# EAGLE design v1 (EAGLE 9.5.2)
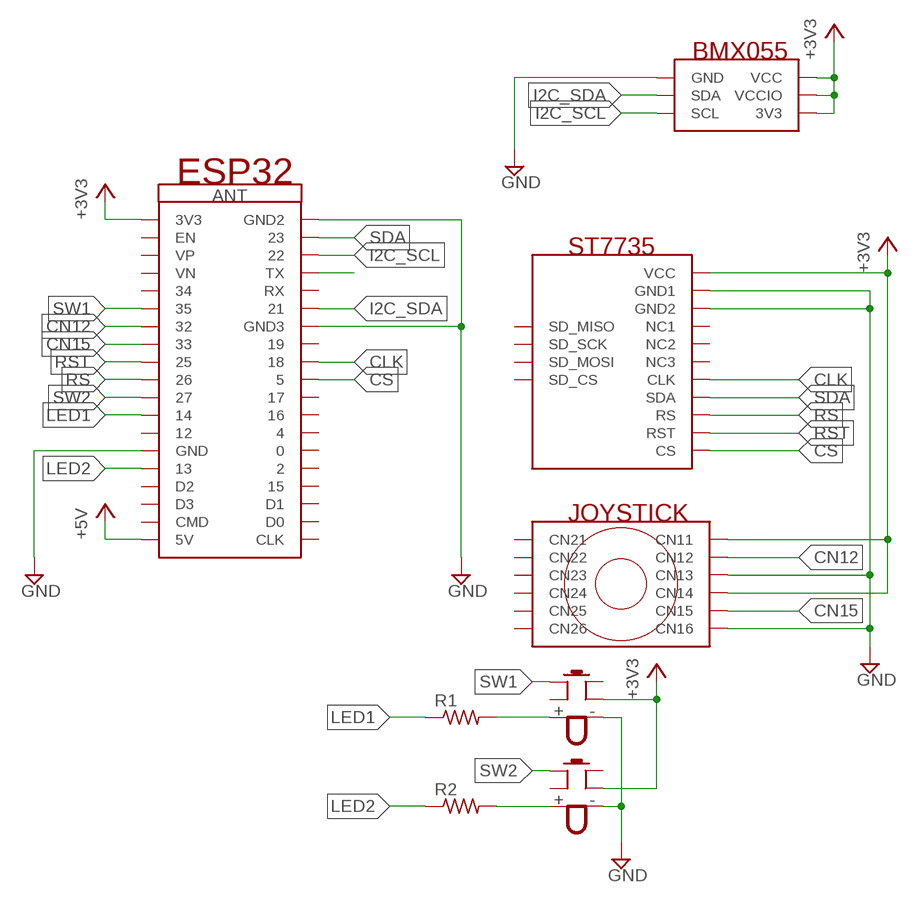
[diagram p0: schematic, sheet 1]

## Parts
R1  R-US_0309/12  [0309/12]
R2  R-US_0309/12  [0309/12]
U$1  ST7735  [ST7735]
U$2  JOYSTICK  [JOYSTICK]
U$3  ESP32  [ESP32]
U$4  PUSH_SW_LED  [PUSH_SW_LED]
U$5  PUSH_SW_LED  [PUSH_SW_LED]
U$6  BMX055  [BMX055]

## Nets
+3V3: U$1.VCC U$2.CN11 U$2.CN14 U$3.3V3 U$4.P$6(P4) U$5.P$6(P4) U$6.3V3 U$6.VCC U$6.VCCIO
+5V: U$3.5V
CLK: U$1.CLK U$3.18
CN12: U$2.CN12 U$3.32
CN15: U$2.CN15 U$3.33
CS: U$1.CS U$3.5
GND: U$1.GND1 U$1.GND2 U$2.CN13 U$2.CN16 U$3.GND U$3.GND2 U$3.GND3 U$4.P$4(PO) U$5.P$4(PO) U$6.GND
I2C_SCL: U$3.22 U$6.SCL
I2C_SDA: U$3.21 U$6.SDA
LED1: R1.1 U$3.14
LED2: R2.1 U$3.13
N$1: U$3.TX
N$3: R1.2 U$4.P$3(PI)
N$4: R2.2 U$5.P$3(PI)
RS: U$1.RS U$3.26
RST: U$1.RST U$3.25
SDA: U$1.SDA U$3.23
SW1: U$3.35 U$4.P$1(P1)
SW2: U$3.27 U$5.P$1(P1)
Unconnected: U$1.NC1 U$1.NC2 U$1.NC3 U$1.SD_CS U$1.SD_MISO U$1.SD_MOSI U$1.SD_SCK U$2.CN21 U$2.CN22 U$2.CN23 U$2.CN24 U$2.CN25 U$2.CN26 U$3.0 U$3.2 U$3.4 U$3.12 U$3.15 U$3.16 U$3.17 U$3.19 U$3.34 U$3.CLK U$3.CMD U$3.D0 U$3.D1 U$3.D2 U$3.D3 U$3.EN U$3.RX U$3.VN U$3.VP U$4.P$2(P2) U$4.P$5(P3) U$5.P$2(P2) U$5.P$5(P3)

## Library data of the parts
R1 R2 = rcl:R-US_: RESISTOR, American symbol; SPICEPREFIX: R
U$1 = ILI9341:ST7735
U$2 = JOYSTICK:JOYSTICK
U$3 = ESP32:ESP32
U$4 U$5 = Switch:PUSH_SW_LED
U$6 = Sensor:BMX055

## Board
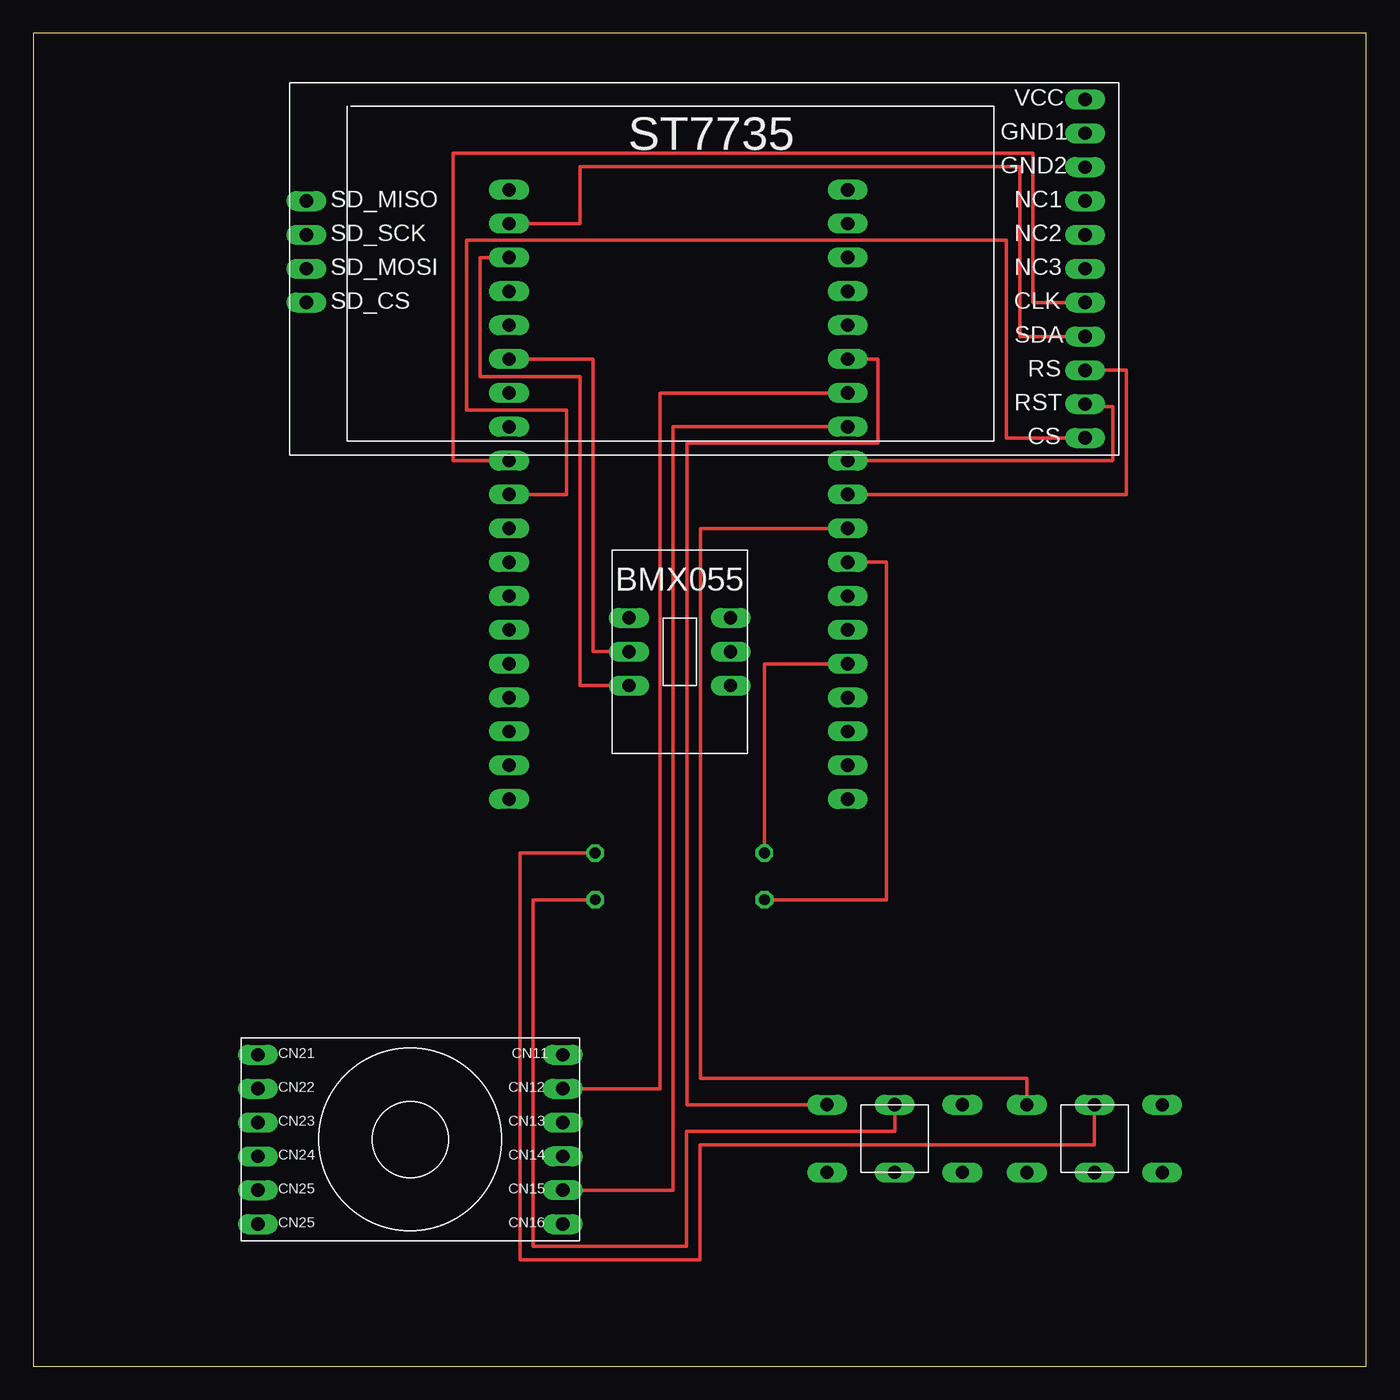
[diagram p1: board, top side]
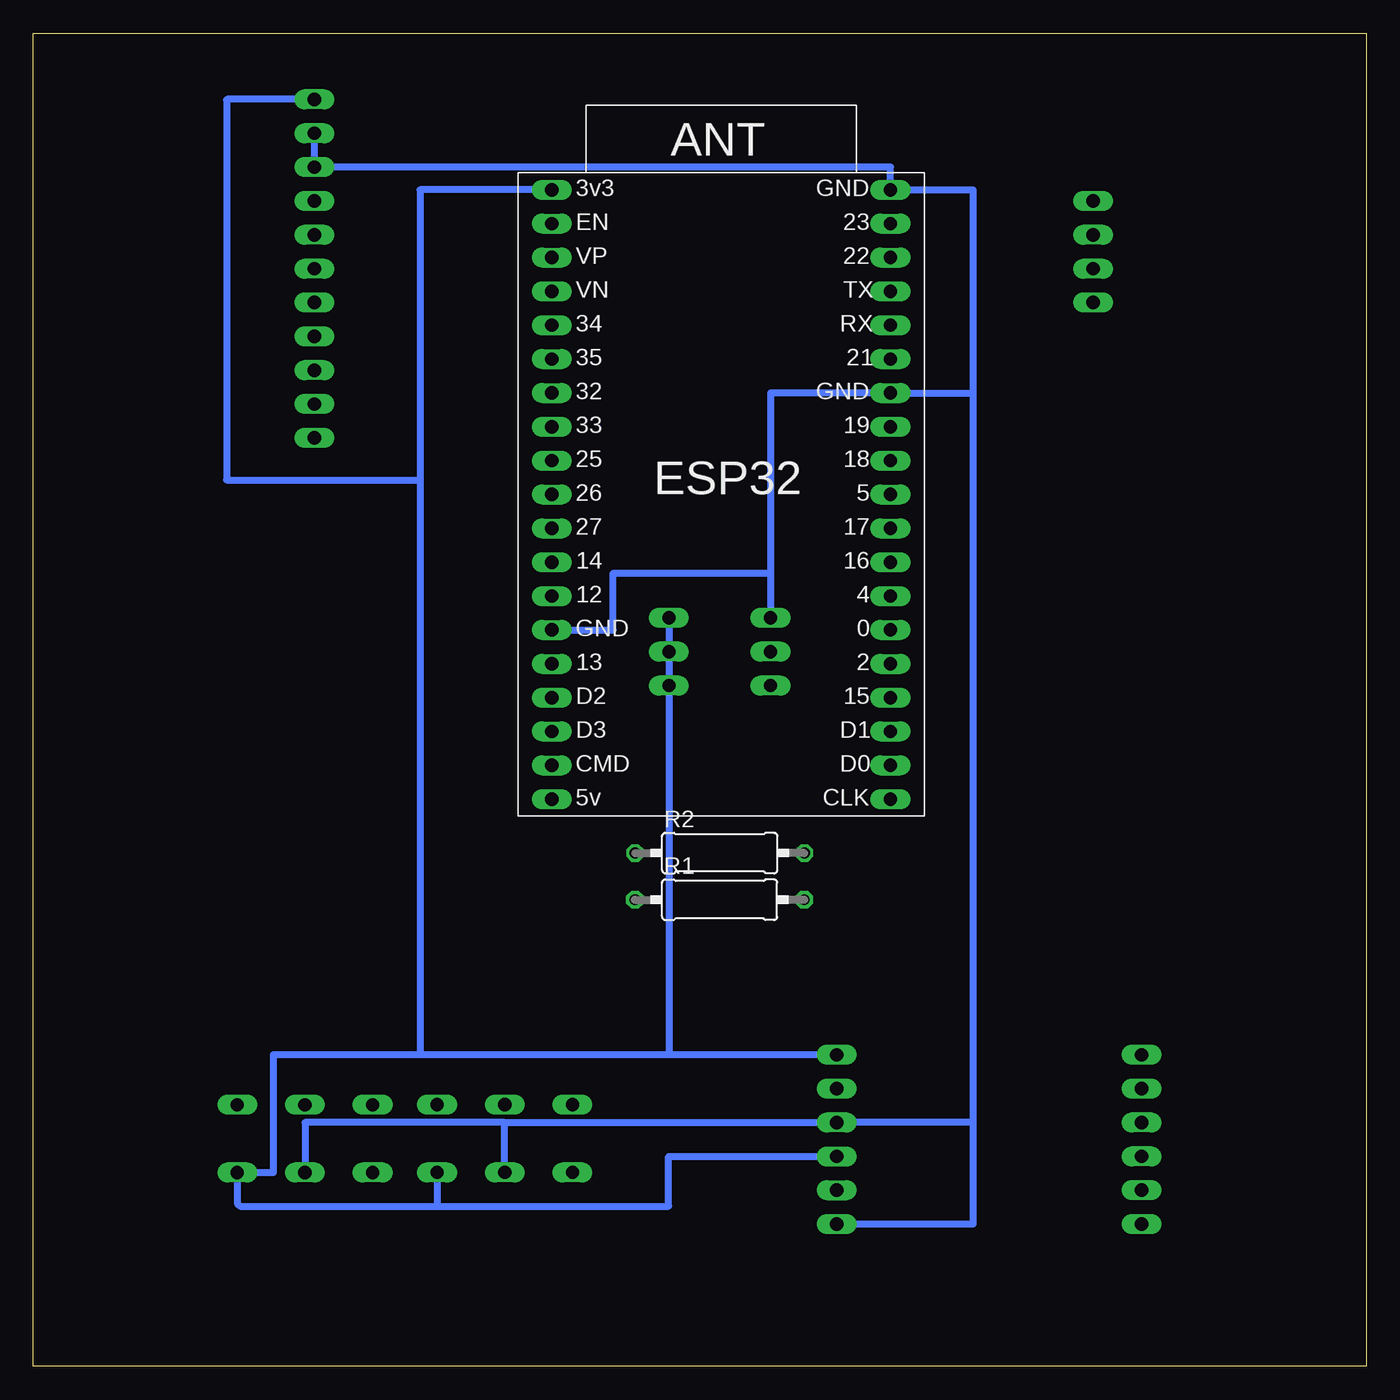
[diagram p2: board, bottom side, seen from below]

Size 100 x 100 mm. Coordinates in mm from the lower left corner, seen from the top.
Outline: 0,0 100,0 100,100 0,100 0,0
Copper layers (1*16): Top 0.035mm / dielectric 1.5mm / Bottom 0.035mm
Design rules "default": minimum track width 6mil, minimum drill 0.35mm, track to track 6mil, track to pad 6mil, pad to pad 6mil, via to via 6mil, smd to smd 6mil, copper to edge 40mil, drill to drill 6mil, minimum pad ring 10mil, minimum via ring 8mil, stop-mask expansion 4mil, vias tented up to drill 0mil, thermal gap 10mil

### Footprints (pad centres in the part's own frame; a part is rotated, then mirrored left to right if it is on the bottom)
0309/12 = drill 0.813 octagon: 1 -6.35,0; 2 6.35,0
ST7735 = drill 1 long: CLK 0,-3.81; CS 0,-13.97; GND1 0,8.89; GND2 0,6.35; NC1 0,3.81; NC2 0,1.27; NC3 0,-1.27; RS 0,-8.89; RST 0,-11.43; SD_CS -58.42,-3.81; SD_MISO -58.42,3.81; SD_MOSI -58.42,-1.27; SD_SCK -58.42,1.27; SDA 0,-6.35; VCC 0,11.43
JOYSTICK = drill 1 long: CN11 19.05,2.54; CN12 19.05,0; CN13 19.05,-2.54; CN14 19.05,-5.08; CN15 19.05,-7.62; CN16 19.05,-10.16; CN21 -3.81,2.54; CN22 -3.81,0; CN23 -3.81,-2.54; CN24 -3.81,-5.08; CN25 -3.81,-7.62; CN26 -3.81,-10.16
ESP32 = drill 1 long: 0 25.4,-33.02; 2 25.4,-35.56; 3V3 0,0; 4 25.4,-30.48; 5 25.4,-22.86; 5V 0,-45.72; 12 0,-30.48; 13 0,-35.56; 14 0,-27.94; 15 25.4,-38.1; 16 25.4,-27.94; 17 25.4,-25.4; 18 25.4,-20.32; 19 25.4,-17.78; 21 25.4,-12.7; 22 25.4,-5.08; 23 25.4,-2.54; 25 0,-20.32; 26 0,-22.86; 27 0,-25.4; 32 0,-15.24; 33 0,-17.78; 34 0,-10.16; 35 0,-12.7; CLK 25.4,-45.72; CMD 0,-43.18; D0 25.4,-43.18; D1 25.4,-40.64; D2 0,-38.1; D3 0,-40.64; EN 0,-2.54; GND 0,-33.02; GND2 25.4,0; GND3 25.4,-15.24; RX 25.4,-10.16; TX 25.4,-7.62; VN 0,-7.62; VP 0,-5.08
PUSH_SW_LED = drill 1 long: P$1 2.54,7.62; P$2 2.54,2.54; P$3 7.62,7.62; P$4 7.62,2.54; P$5 12.7,7.62; P$6 12.7,2.54
BMX055 = drill 1 long: 3V3 3.81,-5.08; GND -3.81,0; SCL -3.81,-5.08; SDA -3.81,-2.54; VCC 3.81,0; VCCIO 3.81,-2.54

### Placement (x,y rotation side)
R1  48.51,35 0 bottom
R2  48.5,38.5 0 bottom
U$1  78.92,83.61 0 top
U$2  20.66,20.82 0 top
U$3  61.09,88.26 0 bottom
U$4  57.01,12 0 top
U$5  72,11.99 0 top
U$6  48.5,56.14 0 top

### Tracks (layer width: path | path; a pad name or v marks a point on that pad's centre or on a via)
+3V3
  Bottom 0.508: U$6.VCC U$6.VCCIO U$6.3V3 52.31,23.36 | U$2.CN11 52.31,23.36 | 52.31,23.36 71,23.36 | 71,23.36 82,23.36 82,14.53 U$5.P$6 84.7,12.2 84.5,12 69.71,12 | U$4.P$6 69.71,12 | 69.71,12 52.34,12 52.34,15.74 U$2.CN14 | U$3.3V3 71,88.26 71,66.5 | 71,66.5 71,23.36 | U$1.VCC 85.46,95.04 85.5,95 85.5,66.5 71,66.5
CLK
  Top 0.254: U$1.CLK 75,79.8 75,91 31.5,91 31.5,67.94 U$3.18
CN12
  Top 0.254: U$2.CN12 47,20.82 47,73.02 U$3.32
CN15
  Top 0.254: U$2.CN15 48,13.2 48,70.5 61.07,70.5 U$3.33
CS
  Top 0.254: U$1.CS 73,69.64 73,84.46 32.5,84.46 32.5,71.72 40,71.72 40,65.4 U$3.5
GND
  Bottom 0.508: 35.71,73 U$3.GND3 | U$1.GND1 U$1.GND2 35.69,89.96 U$3.GND2 29.5,88.26 29.5,73 | U$3.GND 56.5,55.24 56.5,59.5 44.69,59.5 | 29.5,18.28 U$2.CN13 64.63,18.28 | 29.5,18.28 29.5,10.66 U$2.CN16 | U$3.GND3 29.52,73.02 29.5,73 | U$3.GND3 44.69,73.02 44.69,59.5 | 44.69,59.5 U$6.GND | U$4.P$4 64.63,18.28 | 29.5,73 29.5,18.28 | 64.63,18.28 79.62,18.28 U$5.P$4
I2C_SCL
  Top 0.254: U$3.22 33.5,83.18 33.5,74.24 41,74.24 41,51.5 41,51.37 41,51.06 U$6.SCL
I2C_SDA
  Top 0.254: U$6.SDA 42,53.6 42,75.56 U$3.21
LED1
  Top 0.254: U$3.14 64,60.32 64,35 R1.1
LED2
  Top 0.254: R2.1 54.85,52.7 U$3.13
N$3
  Top 0.254: R1.2 37.5,35 37.5,9 49,9 49,17.63 64.63,17.63 U$4.P$3
N$4
  Top 0.254: R2.2 36.5,38.5 36.5,8 50,8 50,16.59 79.62,16.59 U$5.P$3
RS
  Top 0.254: U$3.26 82,65.4 82,74.72 U$1.RS
RST
  Top 0.254: U$1.RST 79.1,72 81,72 81,68 80.94,67.94 U$3.25
SDA
  Top 0.254: U$3.23 41,85.72 41,90 74,90 74,77.26 U$1.SDA
SW1
  Top 0.254: U$4.P$1 49.05,19.62 49.05,69.26 63.38,69.26 63.38,75.56 U$3.35
SW2
  Top 0.254: U$5.P$1 74.54,21.61 50.04,21.61 50.04,62.86 U$3.27